# EAGLE design Lock-In_D2 (EAGLE 7.5.0)
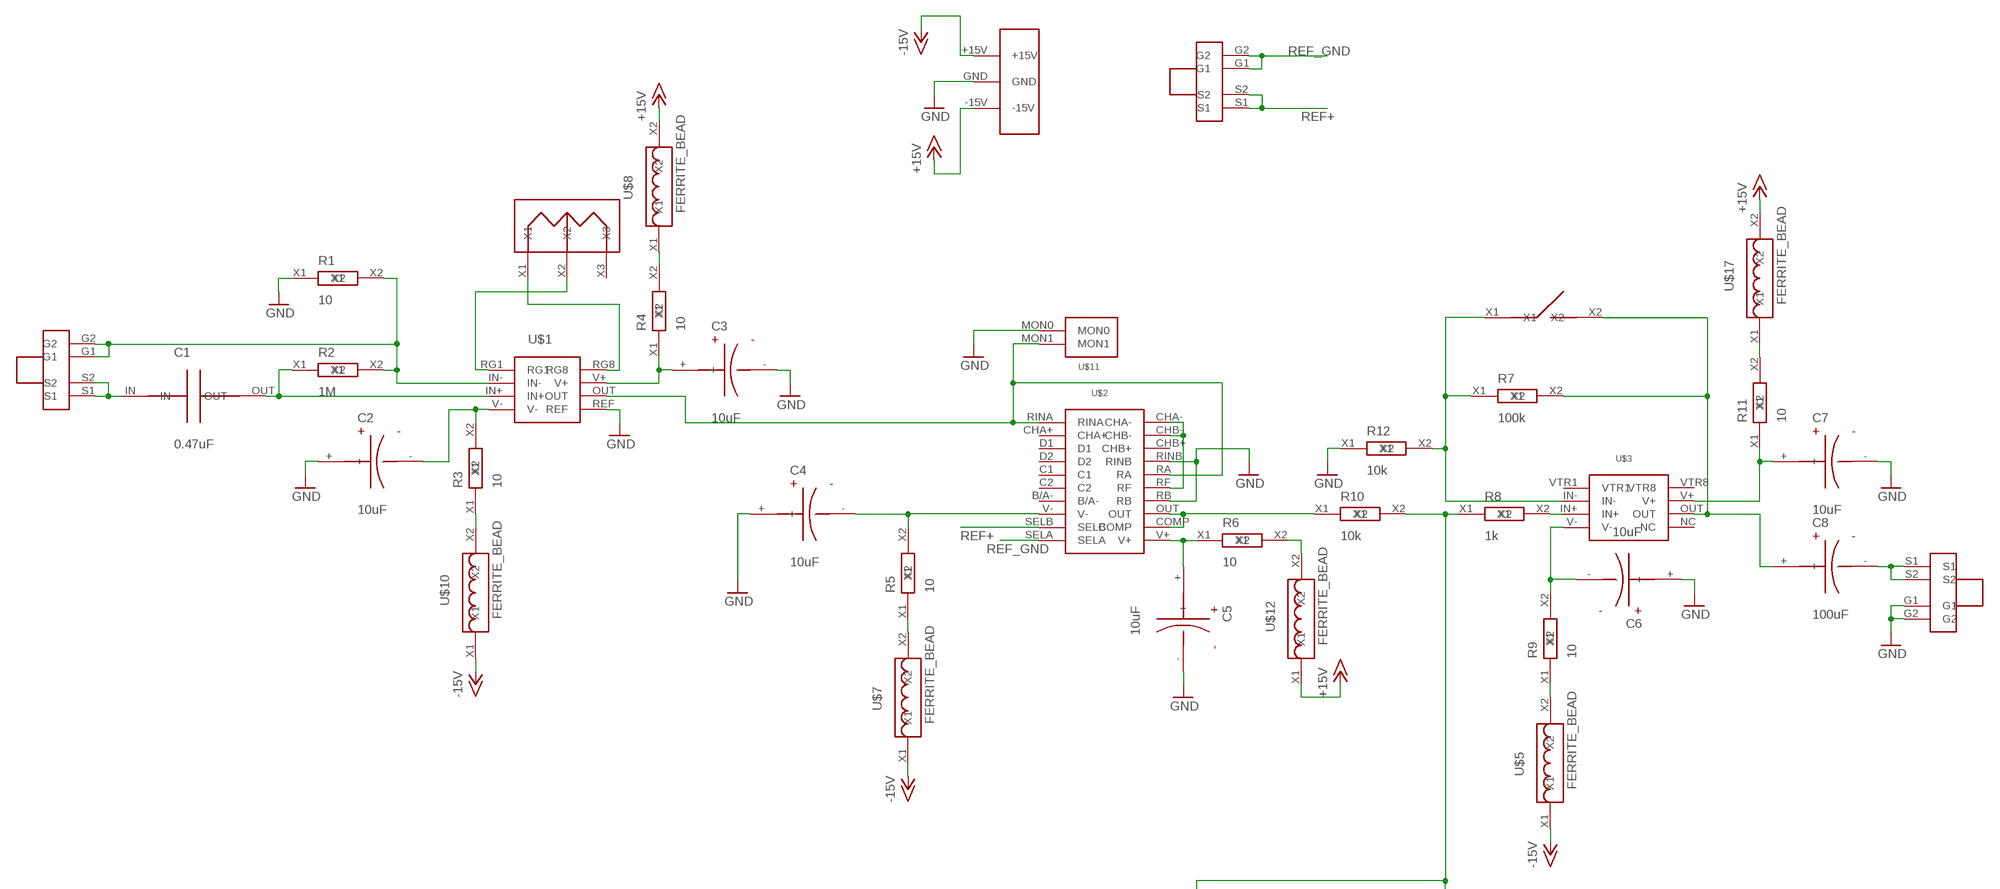
[diagram p0: schematic, sheet 1, part 1 of 2]
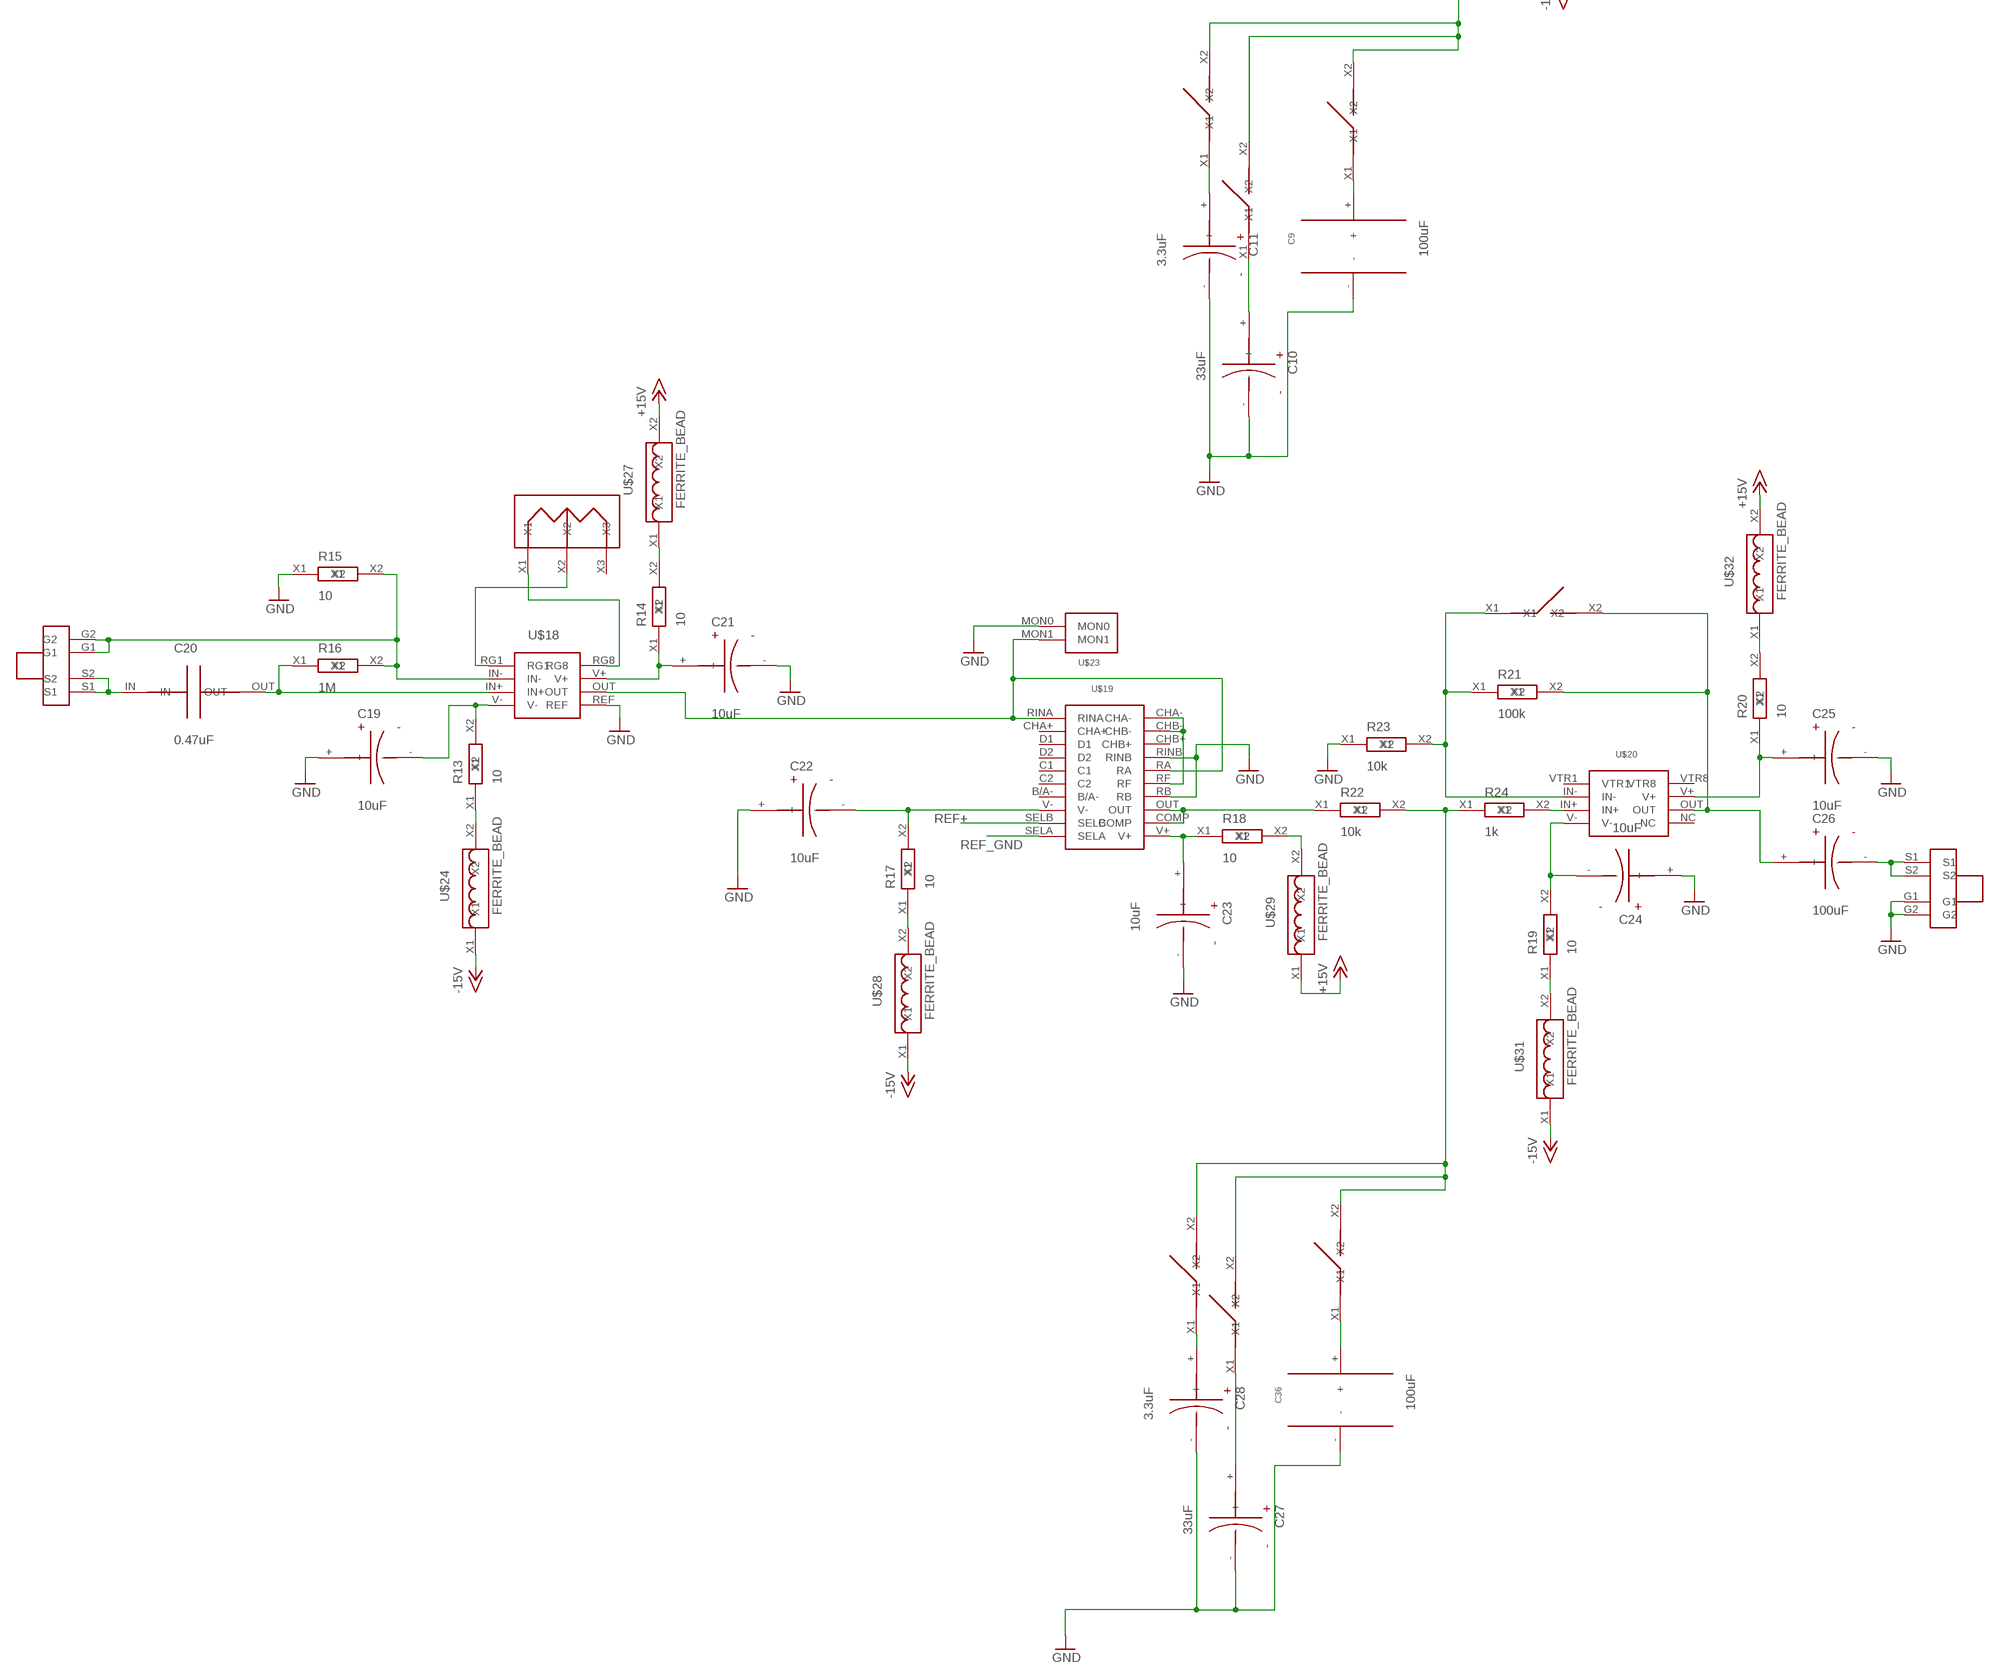
[diagram p1: schematic, sheet 1, part 2 of 2]

## Parts
C1  0.47uF  C_CER_5MM  [C_CER_5MM]
C2  10uF  C_ELT_2MM  [C_ELT_2MM]
C3  10uF  C_ELT_2MM  [C_ELT_2MM]
C4  10uF  C_ELT_2MM  [C_ELT_2MM]
C5  10uF  C_ELT_2MM  [C_ELT_2MM]
C6  10uF  C_ELT_2MM  [C_ELT_2MM]
C7  10uF  C_ELT_2MM  [C_ELT_2MM]
C8  100uF  C_ELT_2MM  [C_ELT_2MM]
C9  100uF  C100UF  [C100UF]
C10  33uF  C_ELT_2MM  [C_ELT_2MM]
C11  3.3uF  C_ELT_2MM  [C_ELT_2MM]
C19  10uF  C_ELT_2MM  [C_ELT_2MM]
C20  0.47uF  C_CER_5MM  [C_CER_5MM]
C21  10uF  C_ELT_2MM  [C_ELT_2MM]
C22  10uF  C_ELT_2MM  [C_ELT_2MM]
C23  10uF  C_ELT_2MM  [C_ELT_2MM]
C24  10uF  C_ELT_2MM  [C_ELT_2MM]
C25  10uF  C_ELT_2MM  [C_ELT_2MM]
C26  100uF  C_ELT_2MM  [C_ELT_2MM]
C27  33uF  C_ELT_2MM  [C_ELT_2MM]
C28  3.3uF  C_ELT_2MM  [C_ELT_2MM]
C36  100uF  C100UF  [C100UF]
R1  10  R_SMD_2.1X1.25  [SMD_2.1X1.25]
R2  1M  R_SMD_2.1X1.25  [SMD_2.1X1.25]
R3  10  R_SMD_2.1X1.25  [SMD_2.1X1.25]
R4  10  R_SMD_2.1X1.25  [SMD_2.1X1.25]
R5  10  R_SMD_2.1X1.25  [SMD_2.1X1.25]
R6  10  R_SMD_2.1X1.25  [SMD_2.1X1.25]
R7  100k  R_SMD_2.1X1.25  [SMD_2.1X1.25]
R8  1k  R_SMD_2.1X1.25  [SMD_2.1X1.25]
R9  10  R_SMD_2.1X1.25  [SMD_2.1X1.25]
R10  10k  R_SMD_2.1X1.25  [SMD_2.1X1.25]
R11  10  R_SMD_2.1X1.25  [SMD_2.1X1.25]
R12  10k  R_SMD_2.1X1.25  [SMD_2.1X1.25]
R13  10  R_SMD_2.1X1.25  [SMD_2.1X1.25]
R14  10  R_SMD_2.1X1.25  [SMD_2.1X1.25]
R15  10  R_SMD_2.1X1.25  [SMD_2.1X1.25]
R16  1M  R_SMD_2.1X1.25  [SMD_2.1X1.25]
R17  10  R_SMD_2.1X1.25  [SMD_2.1X1.25]
R18  10  R_SMD_2.1X1.25  [SMD_2.1X1.25]
R19  10  R_SMD_2.1X1.25  [SMD_2.1X1.25]
R20  10  R_SMD_2.1X1.25  [SMD_2.1X1.25]
R21  100k  R_SMD_2.1X1.25  [SMD_2.1X1.25]
R22  10k  R_SMD_2.1X1.25  [SMD_2.1X1.25]
R23  10k  R_SMD_2.1X1.25  [SMD_2.1X1.25]
R24  1k  R_SMD_2.1X1.25  [SMD_2.1X1.25]
U$1  AD620N  [AD620N]
U$2  AD630  [AD630]
U$3  OP27  [OP27]
U$4  BNC_A  [BNC_A]
U$5  FERRITE_BEAD  [FERRITE_BEAD]
U$6  DIP_1  [DIP_1]
U$7  FERRITE_BEAD  [FERRITE_BEAD]
U$8  FERRITE_BEAD  [FERRITE_BEAD]
U$9  DIP_1  [DIP_1]
U$10  FERRITE_BEAD  [FERRITE_BEAD]
U$11  MON2PIN  [MON2PIN]
U$12  FERRITE_BEAD  [FERRITE_BEAD]
U$13  BNC_A  [BNC_A]
U$14  R_VAR_3296W-1-103LF  [R_VAR_3296W-1-103LF]
U$15  SUPPLY  [SUPPLY]
U$16  BNC_A  [BNC_A]
U$17  FERRITE_BEAD  [FERRITE_BEAD]
U$18  AD620N  [AD620N]
U$19  AD630  [AD630]
U$20  OP27  [OP27]
U$21  DIP_1  [DIP_1]
U$22  DIP_1  [DIP_1]
U$23  MON2PIN  [MON2PIN]
U$24  FERRITE_BEAD  [FERRITE_BEAD]
U$25  R_VAR_3296W-1-103LF  [R_VAR_3296W-1-103LF]
U$26  BNC_A  [BNC_A]
U$27  FERRITE_BEAD  [FERRITE_BEAD]
U$28  FERRITE_BEAD  [FERRITE_BEAD]
U$29  FERRITE_BEAD  [FERRITE_BEAD]
U$30  BNC_A  [BNC_A]
U$31  FERRITE_BEAD  [FERRITE_BEAD]
U$32  FERRITE_BEAD  [FERRITE_BEAD]
U$33  DIP_1  [DIP_1]
U$34  DIP_1  [DIP_1]
U$35  DIP_1  [DIP_1]
U$36  DIP_1  [DIP_1]

## Nets
+15V: U$8.X2 U$12.X1 U$15.-15V U$17.X2 U$27.X2 U$29.X1 U$32.X2
-15V: U$5.X1 U$7.X1 U$10.X1 U$15.+15V U$24.X1 U$28.X1 U$31.X1
GND: C2.+ C3.- C4.+ C5.- C6.+ C7.- C9.- C10.- C11.- C19.+ C21.- C22.+ C23.- C24.+ C25.- C27.- C28.- C36.- R1.X1 R12.X1 R15.X1 R23.X1 U$1.REF U$2.RB U$2.RINB U$4.G1 U$4.G2 U$11.MON0 U$15.GND U$18.REF U$19.RB U$19.RINB U$23.MON0 U$30.G1 U$30.G2
N$1: C1.IN U$16.S1 U$16.S2
N$2: R1.X2 R2.X2 U$1.IN- U$16.G1 U$16.G2
N$3: C1.OUT R2.X1 U$1.IN+
N$4: R3.X1 U$10.X2
N$5: R4.X2 U$8.X1
N$6: C2.- R3.X2 U$1.V-
N$7: C3.+ R4.X1 U$1.V+
N$8: U$1.RG1 U$14.X2
N$9: U$1.RG8 U$14.X1
N$10: R5.X1 U$7.X2
N$11: U$1.OUT U$2.RA U$2.RINA U$11.MON1
N$12: R10.X1 U$2.COMP U$2.OUT
N$13: U$2.CHA- U$2.CHB- U$2.RF
N$14: C20.IN U$26.S1 U$26.S2
N$15: R15.X2 R16.X2 U$18.IN- U$26.G1 U$26.G2
N$16: C5.+ R6.X1 U$2.V+
N$17: R6.X2 U$12.X2
N$18: C8.- U$4.S1 U$4.S2
N$19: C4.- R5.X2 U$2.V-
N$20: R8.X1 R10.X2 U$34.X2 U$35.X2 U$36.X2
N$21: R8.X2 U$3.IN+
N$22: R9.X1 U$5.X2
N$23: C6.- R9.X2 U$3.V-
N$24: R7.X1 R12.X2 U$3.IN- U$9.X1
N$25: C7.+ R11.X1 U$3.V+
N$26: R11.X2 U$17.X1
N$27: C8.+ R7.X2 U$3.OUT U$9.X2
N$28: C20.OUT R16.X1 U$18.IN+
N$29: C9.+ U$36.X1
N$32: C10.+ U$35.X1
N$33: C19.- R13.X2 U$18.V-
N$34: C11.+ U$34.X1
N$40: U$18.RG1 U$25.X2
N$41: U$18.RG8 U$25.X1
N$42: C21.+ R14.X1 U$18.V+
N$43: U$18.OUT U$19.RA U$19.RINA U$23.MON1
N$44: U$19.CHA- U$19.CHB- U$19.RF
N$45: R22.X1 U$19.COMP U$19.OUT
N$46: C22.- R17.X2 U$19.V-
N$47: C23.+ R18.X1 U$19.V+
N$48: R22.X2 R24.X1 U$6.X2 U$21.X2 U$33.X2
N$49: C24.- R19.X2 U$20.V-
N$50: R21.X1 R23.X2 U$20.IN- U$22.X1
N$51: C25.+ R20.X1 U$20.V+
N$52: C26.+ R21.X2 U$20.OUT U$22.X2
N$53: C36.+ U$6.X1
N$54: C27.+ U$33.X1
N$55: C28.+ U$21.X1
N$63: R13.X1 U$24.X2
N$64: R14.X2 U$27.X1
N$65: R17.X1 U$28.X2
N$66: R18.X2 U$29.X2
N$67: C26.- U$30.S1 U$30.S2
N$68: R19.X1 U$31.X2
N$69: R20.X2 U$32.X1
N$70: R24.X2 U$20.IN+
REF+: U$2.SELB U$13.S1 U$13.S2 U$19.SELB
REF_GND: U$2.SELA U$13.G1 U$13.G2 U$19.SELA
Unconnected: U$2.B/A- U$2.C1 U$2.C2 U$2.CHA+ U$2.CHB+ U$2.D1 U$2.D2 U$3.NC U$3.VTR1 U$3.VTR8 U$14.X3 U$19.B/A- U$19.C1 U$19.C2 U$19.CHA+ U$19.CHB+ U$19.D1 U$19.D2 U$20.NC U$20.VTR1 U$20.VTR8 U$25.X3

## Library data of the parts
C1 C20 = MyDuino:C_CER_5MM
C2-C8 C10 C11 C19 C21-C28 = MyDuino:C_ELT_2MM
C9 C36 = MyAmps:C100UF
R1-R24 = MyPowerComponents:R_SMD_2.1X1.25
U$1 U$18 = MyLockIn:AD620N
U$2 U$19 = MyLockIn:AD630
U$3 U$20 = MyLockIn:OP27
U$4 U$13 U$16 U$26 U$30 = MyLockIn:BNC_A
U$5 U$7 U$8 U$10 U$12 U$17 U$24 U$27-U$29 U$31 U$32 = MyLockIn:FERRITE_BEAD
U$6 U$9 U$21 U$22 U$33-U$36 = My_STM32L15x:DIP_1
U$11 U$23 = MyCMOSsensor:MON2PIN
U$14 U$25 = MyLockIn:R_VAR_3296W-1-103LF
U$15 = MyLockIn:SUPPLY

## Board
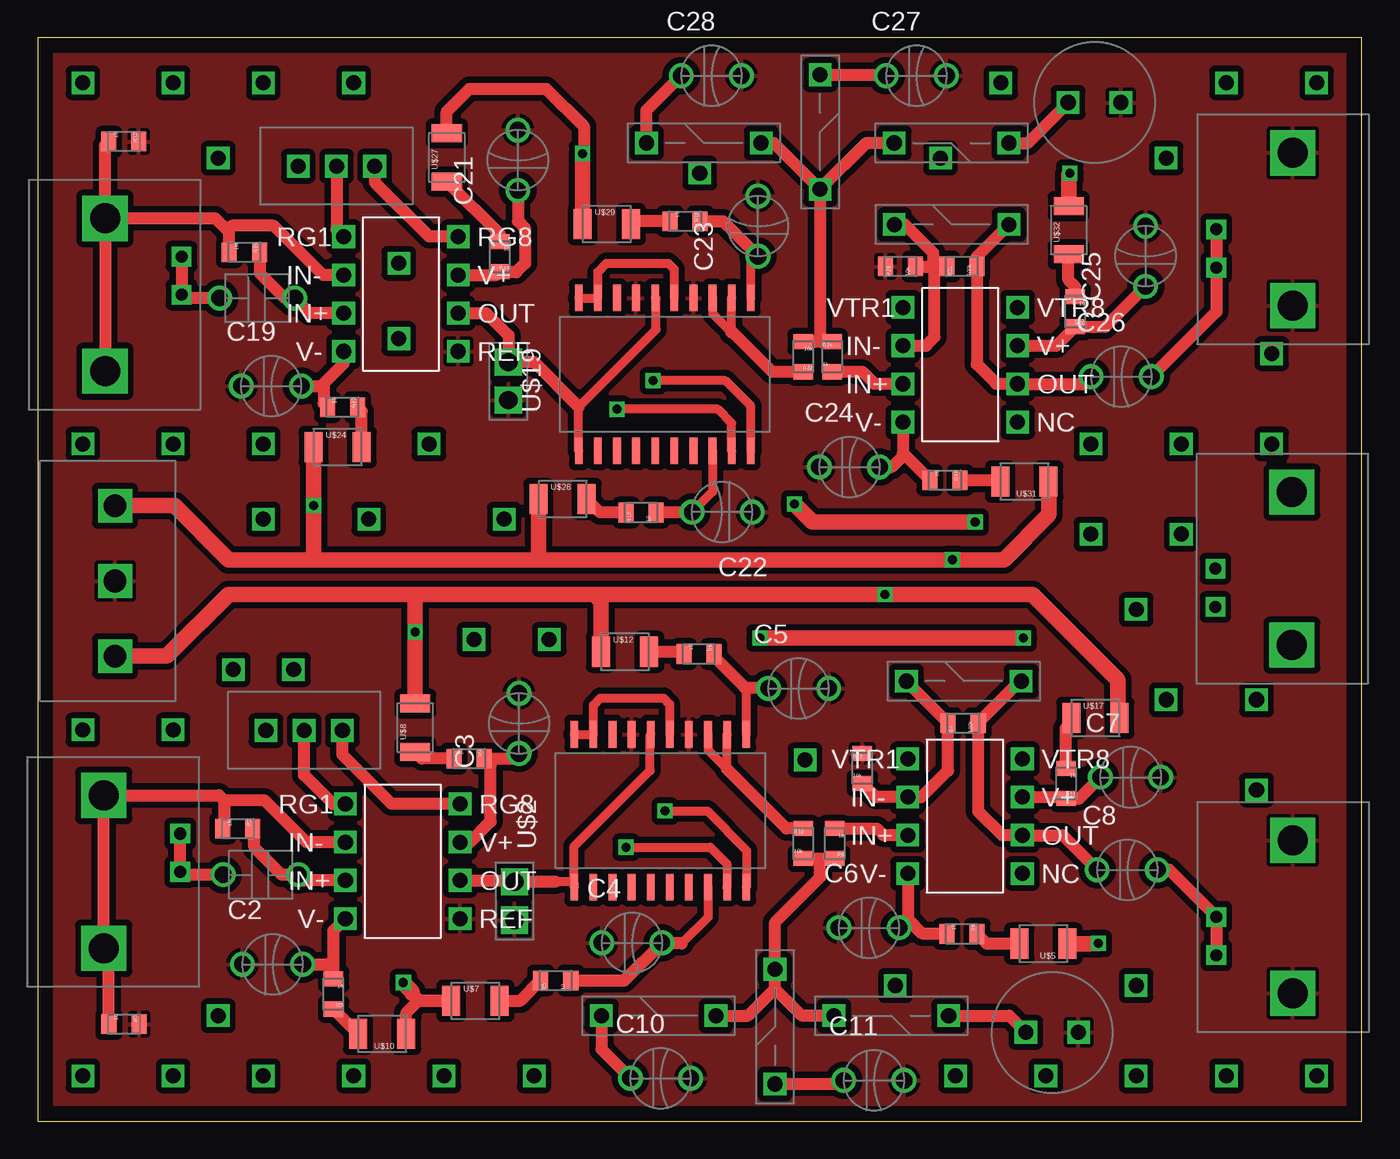
[diagram p2: board, top side]
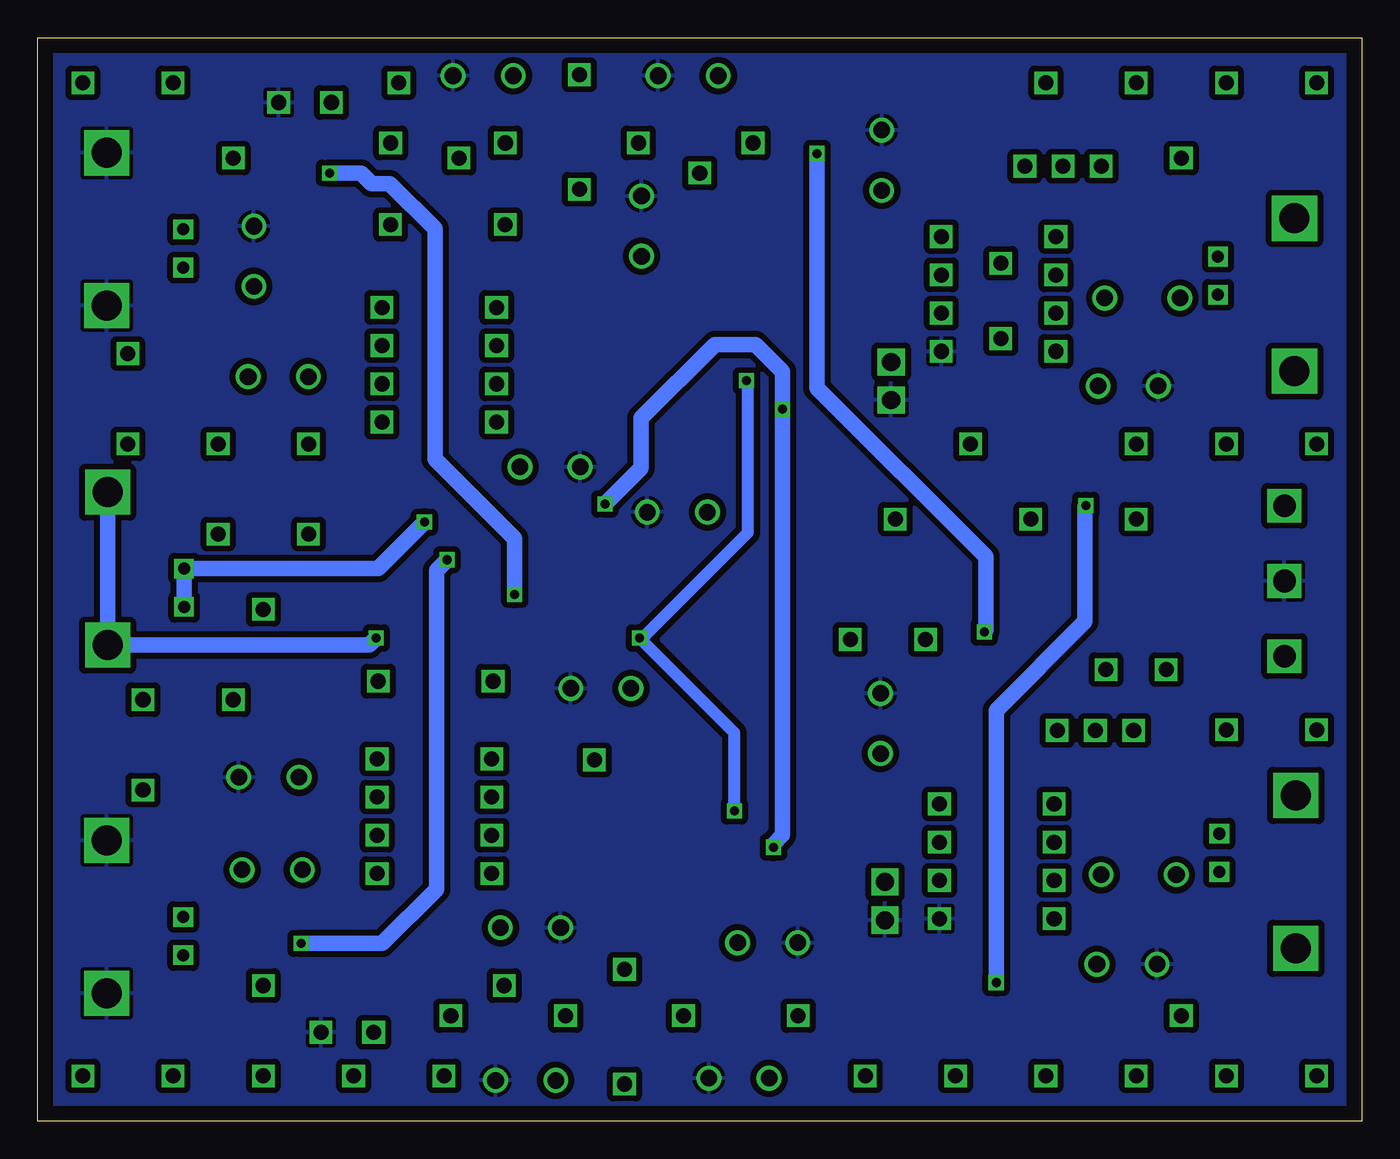
[diagram p3: board, bottom side, seen from below]

Size 88 x 72 mm. Coordinates in mm from the lower left corner, seen from the top.
Outline: 0,0 88,0 88,72 0,72 0,0
Copper layers (1*16): Top 0.035mm / dielectric 1.5mm / Bottom 0.035mm
Design rules "default": minimum track width 10mil, minimum drill 24mil, track to track 8mil, track to pad 8mil, pad to pad 8mil, via to via 8mil, smd to smd 8mil, copper to edge 40mil, drill to drill 8mil, minimum pad ring 10mil, minimum via ring 8mil, stop-mask expansion 4mil, vias tented up to drill 0mil, thermal gap 10mil

### Footprints (pad centres in the part's own frame; a part is rotated, then mirrored left to right if it is on the bottom)
C_CER_5MM = drill 1.1: IN -2.5,0; OUT 2.5,0
C_ELT_2MM = drill 1.1: + -2,0; - 2,0
C100UF = drill 1 square: + -1.75,0; - 1.75,0
SMD_2.1X1.25 = smd 1.3 x 1: X1 0,1; X2 0,-1
AD620N = drill 1 square: IN+ -5.08,0; IN- -5.08,2.54; OUT 2.54,0; REF 2.54,-2.54; RG1 -5.08,5.08; RG8 2.54,5.08; V+ 2.54,2.54; V- -5.08,-2.54
AD630 = smd 1.778 x 0.508: B/A- -5.08,-1.27; C1 -5.08,1.27; C2 -5.08,0; CHA+ -5.08,5.08; CHA- 5.08,6.35; CHB+ 5.08,3.81; CHB- 5.08,5.08; COMP 5.08,-3.81; D1 -5.08,3.81; D2 -5.08,2.54; OUT 5.08,-2.54; RA 5.08,1.27; RB 5.08,-1.27; RF 5.08,0; RINA -5.08,6.35; RINB 5.08,2.54; SELA -5.08,-5.08; SELB -5.08,-3.81; V+ 5.08,-5.08; V- -5.08,-2.54
OP27 = drill 1 square: IN+ -2.54,0; IN- -2.54,2.54; NC 5.08,-2.54; OUT 5.08,0; V+ 5.08,2.54; V- -2.54,-2.54; VTR1 -2.54,5.08; VTR8 5.08,5.08
BNC_A = drill 2 square: G1 5.08,0; G2 -5.08,0 | drill 0.8 square: S1 0,5.08; S2 -2.54,5.08
FERRITE_BEAD = smd 1.2 x 2: X1 0,0; X2 3.2,0
DIP_1 = drill 1 square: X1 0,2.54; X2 0,-5.08
MON2PIN = drill 1.2 square: MON0 0,2.54; MON1 0,0
R_VAR_3296W-1-103LF = drill 1 square: X1 0,2.54; X2 0,0; X3 0,-2.54
SUPPLY = drill 1.5 square: +15V 0,5; -15V 0,-5; GND 0,0

### Placement (x,y rotation side)
C1  14.83,16.37 0 top
C2  15.61,10.42 0 top
C3  31.99,26.42 90 top
C4  39.49,11.85 0 top
C5  50.57,28.75 0 top
C6  55.25,12.85 0 top
C7  72.63,22.85 0 top
C8  72.41,16.7 0 top
C9  67.42,5.89 0 top
C10  41.39,2.85 0 top
C11  55.57,2.7 0 top
C19  15.53,48.85 0 top
C20  14.59,54.69 0 top
C21  31.91,63.85 90 top
C22  45.49,40.47 180 top
C23  47.87,59.47 90 top
C24  53.95,43.47 0 top
C25  73.63,57.47 90 top
C26  72.01,49.47 0 top
C27  58.39,69.47 0 top
C28  44.77,69.47 0 top
C36  70.23,67.69 0 top
R1  5.74,6.44 270 top
R2  13.3,19.44 270 top
R3  19.66,8.44 180 top
R4  28.67,24.09 270 top
R5  34.43,9.34 90 top
R6  43.94,31.04 270 top
R7  61.5,26.44 90 top
R8  52.96,18.44 180 top
R9  61.42,12.44 270 top
R10  50.88,18.44 0 top
R11  68.34,22.44 180 top
R12  54.8,23.44 0 top
R13  20.26,47.44 270 top
R14  30.72,57.44 180 top
R15  5.73,65.09 270 top
R16  13.74,57.74 270 top
R17  40.1,40.44 90 top
R18  43.03,59.79 270 top
R19  60.29,42.59 270 top
R20  68.95,53.79 180 top
R21  61.41,56.79 90 top
R22  50.87,50.79 180 top
R23  57.33,56.79 90 top
R24  52.79,50.79 0 top
U$1  25.53,15.99 0 top
U$2  42.01,20.62 90 top
U$3  60.36,18.99 0 top
U$4  83.41,13.56 90 top
U$5  68.44,11.79 180 top
U$6  62,65 270 top
U$7  27.49,7.99 0 top
U$8  25.09,24.54 90 top
U$9  60.28,29.23 90 top
U$10  24.49,5.79 180 top
U$11  31.69,15.89 180 top
U$12  37.44,31.19 0 top
U$13  83.35,36.71 90 top
U$14  17.71,25.96 270 top
U$15  5.15,35.89 0 top
U$16  4.39,16.56 270 top
U$17  68.69,26.79 0 top
U$18  25.41,53.69 0 top
U$19  42.31,49.62 90 top
U$20  60.04,48.99 0 top
U$21  43,65 90 top
U$22  59.47,59.58 90 top
U$23  31.28,50.44 180 top
U$24  18.34,44.79 0 top
U$25  19.86,63.46 270 top
U$26  4.48,54.91 270 top
U$27  27.19,62.44 90 top
U$28  33.29,41.34 0 top
U$29  36.22,59.6 0 top
U$30  83.41,59.26 90 top
U$31  67.17,42.5 180 top
U$32  68.52,57.6 90 top
U$33  52,67 0 top
U$34  49,5 180 top
U$35  40,7 90 top
U$36  58,7 270 top

### Tracks (layer width: path | path; a pad name or v marks a point on that pad's centre or on a via)
+15V  (via drill 0.6)
  Top 0.813: U$27.X2 27.19,67.09 28.7,68.6 33.8,68.6 36.3,66.1 36.3,64.4 v36.2,64.3
  Top 1.016: U$15.-15V 8.59,30.89 12.7,35 24.9,35 | 24.9,35 37,35 | 37,35 v56.3,35 56.9,35 66.1,35 71.8,29.3 71.8,26.88 U$17.X2 | U$8.X2 v25.09,32.5 25.09,34.81 24.9,35 | U$12.X1 37.44,34.56 37,35 | U$29.X1 36.22,64.28 v36.2,64.3 | U$32.X2 68.52,62.92 v68.6,63
  Bottom 1.016: v36.2,64.3 36.2,48.7 25,37.5 25,32.59 v25.09,32.5 | v68.6,63 66.5,63 65.8,62.3 64.6,62.3 61.6,59.3 61.6,44 56.3,38.7 v56.3,35
-15V  (via drill 0.6)
  Top 0.813: U$10.X1 24.49,7.19 25.3,8 | 25.3,8 U$7.X1 25.31,7.99 25.3,8 | 25.3,8 25.3,8.1 24.9,8.5
  Top 1.016: U$15.+15V 9.11,40.89 12.7,37.3 18,37.3 | 18,37.3 33,37.3 | 33,37.3 60.5,37.3 v60.8,37.3 64.2,37.3 67.2,40.3 67.2,42.47 U$31.X1 | U$24.X1 v18.34,40.9 18.34,37.64 18,37.3 | U$28.X1 33.29,37.59 33,37.3 | 24.9,8.5 24.9,8.6 v24.3,9.2 | U$5.X1 v70.49,11.79 v70.5,11.8
  Bottom 1.016: v24.3,9.2 24.3,27.3 18.4,33.2 18.4,40.84 v18.34,40.9 | v70.5,11.8 65.1,11.8 61.5,15.4 61.5,36.6 v60.8,37.3
GND
  pour Bottom (isolate 0.406): 0,0 88,0 88,72 0,72
  pour Top (isolate 0.406): 0,0 88,0 88,72 0,72
N$1
  Top 0.813: C1.IN 9.66,16.37 U$16.S1 U$16.S2
N$2
  Top 0.813: R1.X2 4.74,11.13 U$16.G1 U$16.G2 12.06,21.64 12.4,21.3 | U$1.IN- 17.87,18.53 15.1,21.3 12.4,21.3 | 12.4,21.3 12.4,19.54 R2.X2
N$3
  Top 0.813: U$1.IN+ 17.71,15.99 C1.OUT 16.23,16.37 14.4,18.2 14.4,19.34 R2.X1
N$4
  Top 0.813: R3.X1 19.66,7.42 U$10.X2
N$5
  Top 0.813: R4.X2 25.54,24.09 U$8.X1
N$6
  Top 0.813: R3.X2 19.66,10 | 19.66,10 19.66,12.66 U$1.V- | C2.- 19.24,10.42 19.66,10
N$7
  Top 0.813: U$1.V+ 28.73,18.53 30.1,19.9 30.1,23.66 R4.X1 31.66,24.09 C3.+
N$8
  Top 0.813: U$1.RG1 19.63,21.07 17.7,23 U$14.X2
N$9
  Top 0.813: U$14.X1 20.25,24.35 23.5,21.1 28.04,21.1 U$1.RG8
N$10
  Top 0.813: U$7.X2 32.08,7.99 R5.X1
N$11
  Top 0.61: U$2.RA 40.7,25.66 40.7,23.3 35.66,18.26 U$2.RINA 35.66,15.74 35.5,15.9 34.4,15.9
  Top 0.813: U$1.OUT 31.2,15.99 | 31.2,15.99 31.59,15.99 U$11.MON1 | 34.4,15.9 31.29,15.9 31.2,15.99
N$12
  Top 0.61: U$2.OUT 44.55,24.65 45.8,23.4 45.8,25.68 U$2.COMP
  Top 0.813: R10.X1 49.76,19.44 45.8,23.4
N$13
  Top 0.61: U$2.CHA- U$2.CHB- 36.93,27.63 37.4,28.1 41.6,28.1 42,27.7 U$2.RF
N$14
  Top 0.813: C20.IN 9.78,54.69 U$26.S1 U$26.S2
N$15
  Top 0.813: U$26.G2 4.48,64.84 R15.X2 | U$26.G2 U$26.G1 | U$18.IN- 18.97,56.23 15.7,59.5 12.9,59.5 12.7,59.3 12.7,59.1 | 12.7,59.1 12.7,57.78 R16.X2 | U$26.G2 11.81,59.99 12.7,59.1
N$16
  Top 0.61: U$2.V+ 47.09,28.71 47,28.8
  Top 0.813: C5.+ 48.52,28.8 47,28.8 44.94,30.86 R6.X1
N$17
  Top 0.813: U$12.X2 42.79,31.19 R6.X2
N$18
  Top 0.813: C8.- 75.19,16.7 U$4.S1 U$4.S2
N$19
  Top 0.61: U$2.V- 44.55,13.55 42.8,11.8
  Top 0.813: 42.8,11.8 41.54,11.8 C4.- 38.98,9.34 R5.X2
N$20
  Top 0.813: U$35.X2 47.2,7 49,8.8 | 49,8.8 U$34.X2 49,13.2 52,16.2 52,17.3 51.9,17.4 52.4,17.4 | U$36.X2 50.8,7 49,8.8 | 52.4,17.4 52.92,17.4 R8.X1 | R10.X2 52.36,17.44 52.4,17.4
N$21
  Top 0.813: R8.X2 55.76,19.44 56.2,19 U$3.IN+
N$22
  Top 0.813: U$5.X2 63.07,11.79 R9.X1
N$23
  Top 0.813: U$3.V- 57.82,13.42 | 57.82,13.42 C6.- | R9.X2 58.8,12.44 57.82,13.42
N$24
  Top 0.813: R12.X2 55.71,21.53 U$3.IN- 58.73,21.53 60.5,23.3 R7.X1 57.74,29.2 U$9.X1
N$25
  Top 0.813: U$3.V+ 68.25,21.53 R11.X1 69.22,21.44 C7.+
N$26
  Top 0.813: U$17.X1 68.69,26.49 68.3,26.1 68.3,23.48 R11.X2
N$27
  Top 0.813: U$9.X2 65.29,29.23 R7.X2 62.5,20.6 64.1,19 U$3.OUT 68.12,18.99 C8.+
N$28
  Top 0.813: U$18.IN+ 18.09,53.69 C20.OUT 16.41,54.69 14.8,56.3 14.8,57.68 R16.X1
N$29
  Top 0.813: U$36.X1 64.56,7 C9.+
N$30  (via drill 1)
  other vias: 3,69
N$31  (via drill 1)
  other vias: 9,69
N$32
  Top 0.813: U$35.X1 37.46,4.78 C10.+
N$33
  Top 0.813: U$18.V- 20.33,50.33 19,49 | 19,49 19,47.7 R13.X2 | C19.- 18.85,48.85 19,49
N$34
  Top 0.813: U$34.X1 53.33,2.46 C11.+
N$35  (via drill 1)
  other vias: 15,69
N$36  (via drill 1)
  other vias: 21,69
N$37  (via drill 1)
  other vias: 3,3
N$38  (via drill 1)
  other vias: 9,3
N$39  (via drill 1)
  other vias: 15,3
N$40
  Top 0.813: U$25.X2 19.86,59.24 U$18.RG1
N$41
  Top 0.813: U$25.X1 22.4,62.4 26,58.8 27.92,58.8 U$18.RG8
N$42
  Top 0.813: U$18.V+ 30.51,56.23 R14.X1 30.76,56.4 31.8,56.4 32.4,57 32.4,59.3 31.91,59.79 C21.+
N$43
  Top 0.61: U$19.RINA 35.96,47.46 41.1,52.6 41.1,54.64 U$19.RA
  Top 0.813: U$18.OUT 29.81,53.69 31.3,52.2 31.3,50.46 | 31.3,50.46 U$23.MON1 | 31.3,50.46 32.96,50.46 35.96,47.46
N$44
  Top 0.61: U$19.CHA- U$19.CHB- 37.23,56.43 37.8,57 41.9,57 42.3,56.6 U$19.RF
N$45
  Top 0.61: U$19.OUT 44.85,53.65 46.1,52.4 46.1,54.68 U$19.COMP
  Top 0.813: 46.1,52.4 46.2,52.4 48.8,49.8 R22.X1
N$46
  Top 0.61: U$19.V- 44.85,41.83 C22.- | 41.13,40.47 R17.X2
  Top 0.813: 41.13,40.47 C22.-
N$47
  Top 0.61: U$19.V+ 47.39,56.99 C23.+
  Top 0.813: R18.X1 45.55,59.79 C23.+
N$48
  Top 0.813: R22.X2 51.7,51.79 | 51.7,51.79 R24.X1 | U$33.X2 52,52.09 51.7,51.79 | U$21.X2 48.92,65 U$33.X2 | U$6.X2 55.08,65 U$33.X2
N$49
  Top 0.813: U$20.V- 57.5,44.38 57.59,44.29 | 57.59,44.29 R19.X2 | C24.- 56.77,43.47 57.59,44.29
N$50
  Top 0.813: U$20.IN- 59.03,51.53 59.6,52.1 59.6,56.79 | R23.X2 59.6,56.79 | 59.6,56.79 R21.X1 | U$22.X1 57.62,59.58 59.5,57.7 59.5,56.89 59.6,56.79
N$51
  Top 0.813: U$20.V+ 67.69,51.53 R20.X1 70.95,52.79 C25.+
N$52
  Top 0.813: U$22.X2 62.41,57.44 R21.X2 62.41,50.29 63.7,49 U$20.OUT 69.53,48.99 C26.+
N$53
  Top 0.813: U$6.X1 65.79,65 C36.+
N$54
  Top 0.813: U$33.X1 56.32,69.54 C27.+
N$55
  Top 0.813: U$21.X1 40.46,67.16 C28.+
N$56  (via drill 1)
  other vias: 21,3
N$57  (via drill 1)
  other vias: 27,3
N$58  (via drill 1)
  other vias: 33,3
N$59  (via drill 1)
  other vias: 12,7
N$60  (via drill 1)
  other vias: 12,64
N$61  (via drill 1)
  other vias: 70,45
N$62  (via drill 1)
  other vias: 76,45
N$63
  Top 0.813: U$24.X2 21.54,47.16 R13.X1
N$64
  Top 0.813: R14.X2 30.72,58.91 U$27.X1
N$65
  Top 0.813: R17.X1 37.39,40.44 U$28.X2
N$66
  Top 0.813: R18.X2 39.61,59.79 U$29.X2
N$67
  Top 0.813: C26.- 78.33,53.79 U$30.S2 U$30.S1
N$68
  Top 0.813: R19.X1 63.88,42.59 U$31.X2
N$69
  Top 0.813: R20.X2 68.95,55.45 68.5,55.9 68.5,57.58 U$32.X1
N$70
  Top 0.813: R24.X2 54.81,49.79 55.6,49 U$20.IN+
N$71  (via drill 1)
  other vias: 76,39
N$72  (via drill 1)
  other vias: 70,39
N$73  (via drill 1)
  other vias: 82,45
N$74  (via drill 1)
  other vias: 82,51
N$75  (via drill 1)
  other vias: 75,28
N$76  (via drill 1)
  other vias: 81,28
N$77  (via drill 1)
  other vias: 81,22
N$78  (via drill 1)
  other vias: 85,69
N$79  (via drill 1)
  other vias: 79,69
N$80  (via drill 1)
  other vias: 75,64
N$81  (via drill 1)
  other vias: 85,3
N$82  (via drill 1)
  other vias: 79,3
N$83  (via drill 1)
  other vias: 73,3
N$84  (via drill 1)
  other vias: 73,9
N$85  (via drill 1)
  other vias: 67,3
N$86  (via drill 1)
  other vias: 61,3
N$87  (via drill 1)
  other vias: 29,32
N$88  (via drill 1)
  other vias: 34,32
N$89  (via drill 1)
  other vias: 3,26
N$90  (via drill 1)
  other vias: 9,26
N$91  (via drill 1)
  other vias: 13,30
N$92  (via drill 1)
  other vias: 17,30
N$93  (via drill 1)
  other vias: 3,45
N$94  (via drill 1)
  other vias: 9,45
N$95  (via drill 1)
  other vias: 15,45
N$96  (via drill 1)
  other vias: 15,40
N$97  (via drill 1)
  other vias: 22,40
N$98  (via drill 1)
  other vias: 26,45
N$99  (via drill 1)
  other vias: 24,52
N$100  (via drill 1)
  other vias: 24,57
N$101  (via drill 1)
  other vias: 31,40
N$102  (via drill 1)
  other vias: 73,34
N$103  (via drill 1)
  other vias: 57,9
N$104  (via drill 1)
  other vias: 51,24
N$105  (via drill 1)
  other vias: 64,69
N$106  (via drill 1)
  other vias: 60,64
N$107  (via drill 1)
  other vias: 44,63
REF+  (via drill 0.6)
  Top 0.61: U$19.SELB 46.12,46.38 45.2,47.3 v38.5,47.3 | v39.1,18.2 44.7,18.2 45.8,17.1 45.8,15.56 U$2.SELB
  Top 1.016: v62.3,39.8 51.5,39.8 v50.3,41
  Bottom 1.016: v62.3,39.8 65.39,36.71 U$13.S1 U$13.S2 | v50.3,41 47.9,43.4 47.9,46.7 43,51.6 40.3,51.6 38.5,49.8 38.5,48.3 v38.5,47.3 38.5,19 39.1,18.4 v39.1,18.2
REF_GND  (via drill 0.6)
  Top 0.61: U$19.SELA 47.39,47.51 45.7,49.2 v40.9,49.2 | v41.7,20.6 44.5,20.6 47.1,18 U$2.SELA
  Top 1.016: v65.5,32.1 v48,32.1
  Bottom 0.813: v41.7,20.6 41.7,25.8 v48,32.1 | 47.8,32.1 40.8,39.1 40.8,49.1 v40.9,49.2
  Bottom 1.016: U$13.G2 82.5,31.63 | 82.5,31.63 65.97,31.63 v65.5,32.1 | v48,32.1 47.8,32.1 | U$13.G1 83.35,32.48 82.5,31.63